# Altium schematic sheet XY-V17B原理图.SchDoc
size A4
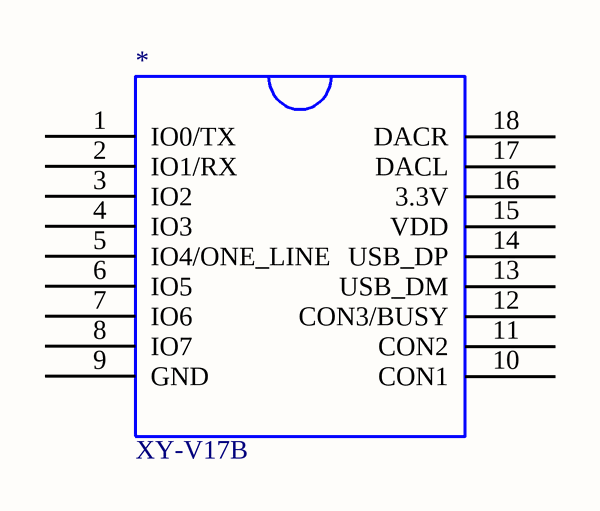
[diagram p0: XY-V17B原理图.SchDoc]

## Parts
*  XY-V17B

## Nets

Not connected (* = marked no-connect by the designer): * 1(IO0/TX) 2(IO1/RX) 3(IO2) 4(IO3) 5(IO4/ONE_LINE) 6(IO5) 7(IO6) 8(IO7) 9(GND) 10(CON1) 11(CON2) 12(CON3/BUSY) 13(USB_DM) 14(USB_DP) 15(VDD) 16(3.3V) 17(DACL) 18(DACR)

## Library data of the parts
* = MODULE